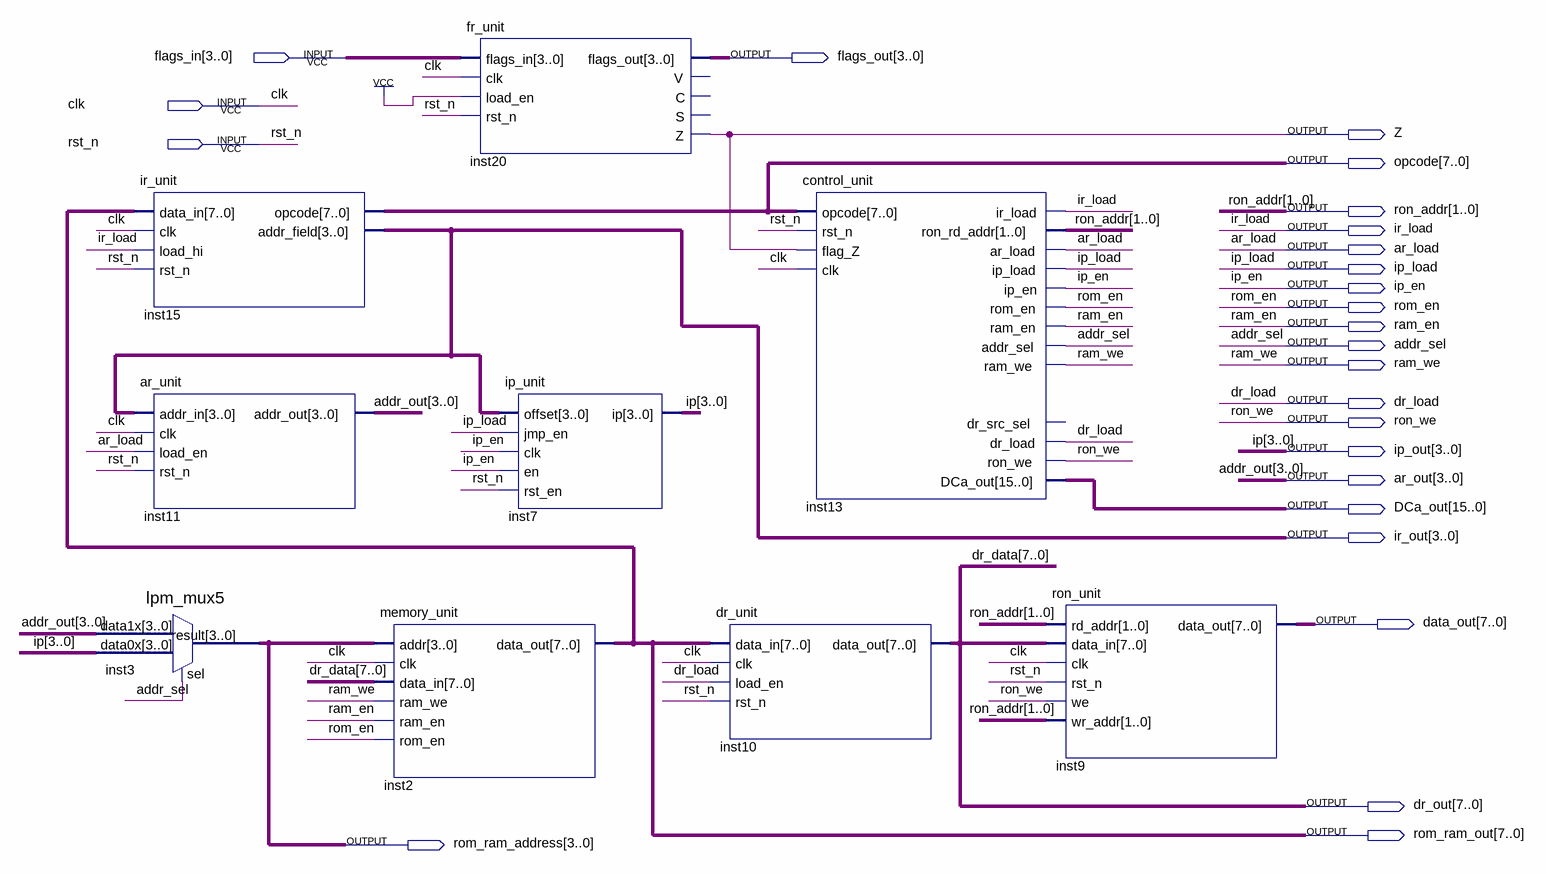
[diagram p0: schematic sheet]
// Quartus schematic lab4_var2_v1.bdf as structural Verilog: 9 symbols, 25 pins
module lab4_var2_v1 (
  input  [3:0] flags_in,
  input  clk,
  input  rst_n,
  output [3:0] flags_out,
  output Z,
  output [7:0] opcode,
  output [1:0] ron_addr,
  output ir_load,
  output ar_load,
  output ip_load,
  output ip_en,
  output rom_en,
  output ram_en,
  output addr_sel,
  output ram_we,
  output dr_load,
  output ron_we,
  output [3:0] ip_out,
  output [3:0] ar_out,
  output [15:0] DCa_out,
  output [3:0] ir_out,
  output [7:0] data_out,
  output [7:0] dr_out,
  output [7:0] rom_ram_out,
  output [3:0] rom_ram_address
);

  lpm_mux5 inst3 (.data1x(ar_out), .data0x(ip_out), .sel(addr_sel), .result(rom_ram_address));
  ir_unit inst15 (
    .data_in(rom_ram_out), .clk(clk), .load_hi(ir_load), .rst_n(rst_n), .opcode(opcode), .addr_field(ir_out));
  ar_unit inst11 (.addr_in(ir_out), .clk(clk), .load_en(ar_load), .rst_n(rst_n), .addr_out(ar_out));
  memory_unit inst2 (
    .addr(rom_ram_address), .clk(clk), .data_in(dr_out), .ram_we(ram_we), .ram_en(ram_en), .rom_en(rom_en),
    .data_out(rom_ram_out));
  fr_unit inst20 (
    .flags_in(flags_in), .clk(clk), .load_en(1'b1), .rst_n(rst_n), .flags_out(flags_out), .Z(Z));  // open: V, C, S
  ip_unit inst7 (.offset(ir_out), .jmp_en(ip_load), .clk(ip_en), .en(ip_en), .rst_en(rst_n), .ip(ip_out));
  dr_unit inst10 (.data_in(rom_ram_out), .clk(clk), .load_en(dr_load), .rst_n(rst_n), .data_out(dr_out));
  control_unit inst13 (
    .opcode(opcode), .rst_n(rst_n), .flag_Z(Z), .clk(clk), .ir_load(ir_load), .ron_rd_addr(ron_addr),
    .ar_load(ar_load), .ip_load(ip_load), .ip_en(ip_en), .rom_en(rom_en), .ram_en(ram_en),
    .addr_sel(addr_sel), .ram_we(ram_we), .dr_load(dr_load), .ron_we(ron_we), .DCa_out(DCa_out));  // open: dr_src_sel
  ron_unit inst9 (
    .rd_addr(ron_addr), .data_in(dr_out), .clk(clk), .rst_n(rst_n), .we(ron_we), .wr_addr(ron_addr),
    .data_out(data_out));

  // Other names for the same wires on the sheet: addr_out[3:0] = ar_out; dr_data[7:0] = dr_out; ip[3:0] = ip_out
endmodule
